# Altium schematic sheet 1_Sheet_1.schdoc
size 220 x 160 mm; Symbol: Sheet-Symbol_A5; Device: Sheet-Symbol_A5; @Page Name: Sheet_1.NFC地图卡; @Create Date: 2023-07-19; @Page Count: 1; @Page No: 1; @Project Name: UltraPCB-上海电砖NFC校园地图卡; @Schematic Name: NFC地图卡; @Update Date: 2023-07-19; Company: 嘉立创EDA; Page Size: A5; Version: V1.0
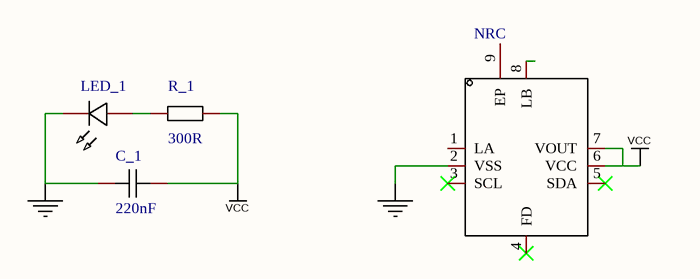
[diagram p0: 1_Sheet_1.schdoc]

## Parts
C_1  value 220nF  [C0402]  (hidden comment: CAP_0603)
LED_1  LED_0603-R  [LED_0402]  (value not drawn)
NRC  NT3H1101W0FHKH  [XQFN-8_L1.6-W1.6-P0.50-BR]  (value not drawn)
R_1  value 300R  [R0402]  (hidden comment: Res_0603)

## Nets
NetC_1_1: C_1.1 LED_1.1(C) NRC.2(VSS)
VCC: C_1.2 NRC.6(VCC) NRC.7(VOUT) R_1.2
NetLED_1_2: LED_1.2(A) R_1.1

Not connected (* = marked no-connect by the designer): NRC 1(LA) 3(SCL)* 4(FD)* 5(SDA)* 8(LB) 9(EP)

## Notes on the sheet
- 1
- 2
- 3
- 4
- 5
- 6
- A
- B
- C
- 原理图
- NFC地图卡
- 创建日期
- 更新日期
- 2023-07-19
- 审阅
- 绘制
- 图页
- Sheet_1.NFC地图卡
- 物料编码
- UltraPCB-上海电砖NFC校园地图卡
- D
- 版本
- 尺寸
- 页
- 共
- V1.0
- A5
- 嘉立创EDA

## Library data of the parts
C_1 = CAP_0603: Symbol: CapAcitance; Convert to PCB: yes; Name: 220nF; Device: CAP_0603; Add into BOM: yes; Supplier Footprint: 0603
LED_1 = LED_0603-R: Symbol: LED_R; Convert to PCB: yes; Device: LED_0603-R; Add into BOM: yes; Supplier Footprint: 0603
NRC = NT3H1101W0FHKH: Manufacturer: NXP(恩智浦); Add into BOM: yes; Name: NT3H1101W0FHKH; Symbol: NT3H1101W0FHKH; Device: NT3H1101W0FHKH; Convert to PCB: yes; LCSC Part Name: NT3H1101W0FHKH; Supplier Part: C73156; Manufacturer Part: NT3H1101W0FHKH; Supplier Footprint: XQFN-8; JLCPCB Part Class: 扩展库; Datasheet: https://atta.szlcsc.com/upload/public/pdf/source/20171113/C73156_15105616225541116096.pdf; Supplier: LCSC; Origin Footprint 2: XQFN-8_L1.6-W1.6-P0.50-BR
R_1 = Res_0603: Symbol: 电阻; Convert to PCB: yes; Name: 300R; Device: Res_0603; Add into BOM: yes; Supplier Footprint: 0603